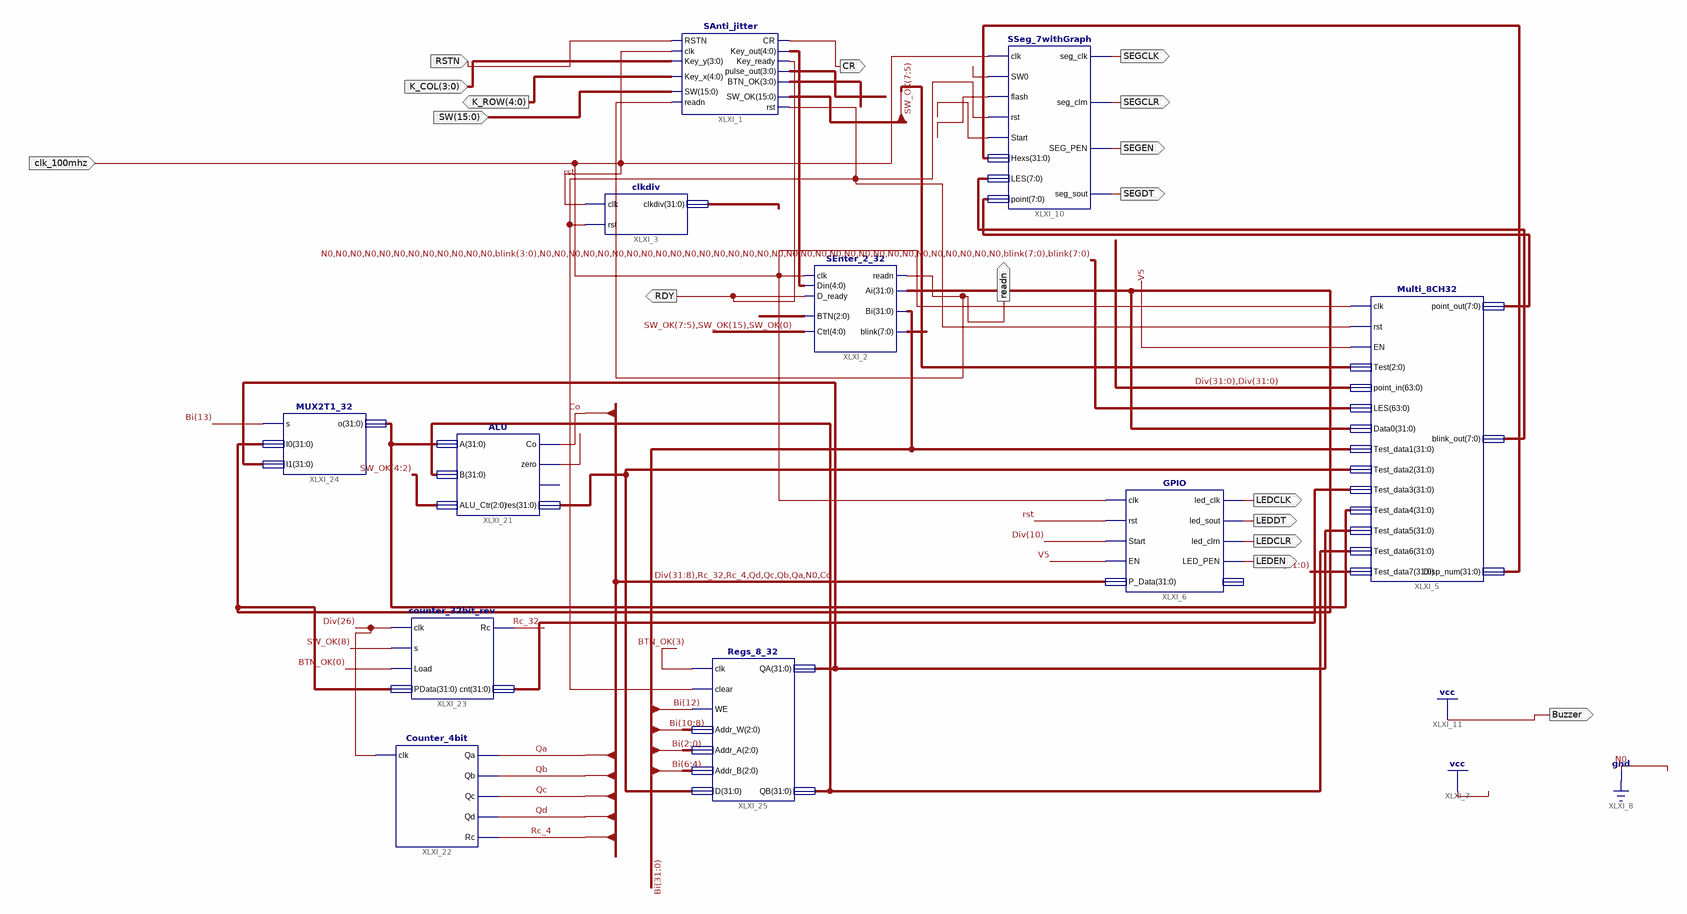
[diagram p0: schematic sheet 1]
// Xilinx ISE schematic Framework.sch (kintex7) as structural Verilog: 11 symbols, 17 ports
module Framework (
  input  RSTN,
  input  [3:0] K_COL,
  input  [15:0] SW,
  input  clk_100mhz,
  output [4:0] K_ROW,
  output readn,
  output CR,
  output RDY,
  output LEDCLK,
  output LEDDT,
  output LEDCLR,
  output LEDEN,
  output SEGCLK,
  output SEGCLR,
  output SEGEN,
  output SEGDT,
  output Buzzer
);

  wire Co, Qa, Qb, Qc, Qd, Rc_4, Rc_32, rst, zero;
  wire [3:0] BTN_OK, Pulse;
  wire [4:0] XLXN_18;
  wire [7:0] blink, XLXN_27, XLXN_28;
  wire [15:0] SW_OK;
  wire [31:0] Bi, Div, XLXN_30, XLXN_88, XLXN_89, XLXN_90, XLXN_91, XLXN_96, XLXN_120;

  GPIO XLXI_6 (
    .clk(clk_100mhz), .rst(rst), .Start(Div[10]), .EN(1'b1),
    .P_Data({Div[31:8], Rc_32, Rc_4, Qd, Qc, Qb, Qa, 1'b0, Co}), .led_clk(LEDCLK), .led_sout(LEDDT),
    .led_clrn(LEDCLR), .LED_PEN(LEDEN));  // open: GPIOf0
  Multi_8CH32 XLXI_5 (
    .clk(clk_100mhz), .rst(rst), .EN(1'b1), .Test(SW_OK[7:5]), .point_in({Div, Div}),
    .LES({{12{1'b0}}, blink[3:0], {32{1'b0}}, blink, blink}), .Data0(XLXN_88), .Test_data1(Bi),
    .Test_data2(XLXN_96), .Test_data3(XLXN_120), .Test_data4(XLXN_90), .Test_data5(XLXN_89),
    .Test_data6(XLXN_91), .Test_data7(Div), .point_out(XLXN_27), .blink_out(XLXN_28), .Disp_num(XLXN_30));
  SSeg_7withGraph XLXI_10 (
    .clk(clk_100mhz), .SW0(SW_OK[0]), .flash(Div[25]), .rst(rst), .Start(Div[10]), .Hexs(XLXN_30),
    .LES(XLXN_28), .point(XLXN_27), .seg_clk(SEGCLK), .seg_clrn(SEGCLR), .SEG_PEN(SEGEN), .seg_sout(SEGDT));
  SAnti_jitter XLXI_1 (
    .SW(SW), .readn(readn), .Key_y(K_COL), .Key_x(K_ROW), .RSTN(RSTN), .clk(clk_100mhz), .Key_out(XLXN_18),
    .Key_ready(RDY), .CR(CR), .rst(rst), .SW_OK(SW_OK), .pulse_out(Pulse), .BTN_OK(BTN_OK));
  clkdiv XLXI_3 (.clk(clk_100mhz), .rst(rst), .clkdiv(Div));
  SEnter_2_32 XLXI_2 (
    .readn(readn), .Ai(XLXN_88), .Bi(Bi), .blink(blink), .Din(XLXN_18), .D_ready(RDY), .clk(clk_100mhz),
    .Ctrl({SW_OK[7:5], SW_OK[15], SW_OK[0]}), .BTN(BTN_OK[2:0]));
  ALU XLXI_21 (.A(XLXN_90), .B(XLXN_91), .ALU_Ctr(SW_OK[4:2]), .Co(Co), .zero(zero), .res(XLXN_96));  // open: overflow
  Counter_4bit XLXI_22 (.clk(Div[26]), .Qa(Qa), .Qb(Qb), .Qc(Qc), .Qd(Qd), .Rc(Rc_4));
  counter_32bit_rev XLXI_23 (
    .clk(Div[26]), .s(SW_OK[8]), .Load(BTN_OK[0]), .PData(XLXN_88), .Rc(Rc_32), .cnt(XLXN_120));
  MUX2T1_32 XLXI_24 (.s(Bi[13]), .I0(XLXN_88), .I1(XLXN_89), .o(XLXN_90));
  Regs_8_32 XLXI_25 (
    .clk(BTN_OK[3]), .clear(rst), .WE(Bi[12]), .Addr_W(Bi[10:8]), .Addr_A(Bi[2:0]), .Addr_B(Bi[6:4]),
    .D(XLXN_96), .QA(XLXN_89), .QB(XLXN_91));

  assign Buzzer = 1'b1;
endmodule
